# EAGLE design cj-buttons (EAGLE 7.7.0)
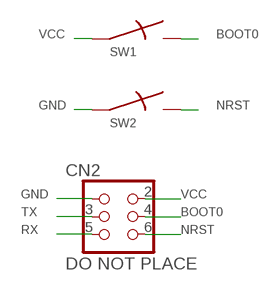
[diagram p0: schematic, sheet 1]

## Parts
CN2  DO NOT PLACE  HEADER-3X2-PTH1.27  [HEADER-3X2-PTH1.27]
SW1  SWITCHKMR211  [KMR211]
SW2  SWITCHKMR211  [KMR211]

## Nets
BOOT0: CN2.4 SW1.2 SW1.4
GND: CN2.1 SW2.1 SW2.3
NRST: CN2.6 SW2.2 SW2.4
RX: CN2.5
TX: CN2.3
VCC: CN2.2 SW1.1 SW1.3

## Library data of the parts
CN2 = jaw-conn:HEADER-3X2
SW1 SW2 = jaw:SWITCH

## Board
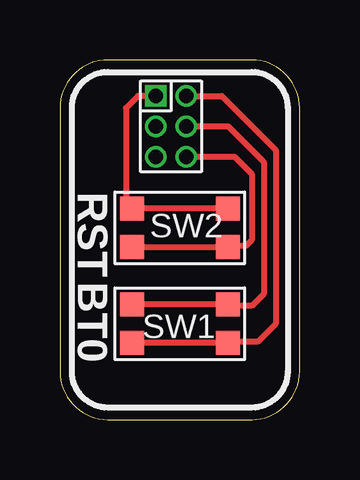
[diagram p1: board, top side]
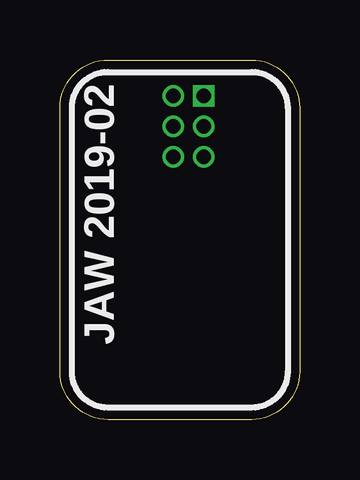
[diagram p2: board, bottom side, seen from below]

Size 10 x 15 mm. Coordinates in mm from the lower left corner, seen from the top.
Outline: 0,13 0,2 arc90 2,0 8,0 arc90 10,2 10,13 arc90 8,15 2,15 arc90 0,13
Copper layers (1*16): Top 0.035559375mm / dielectric 1.6mm / Bottom 0.035559375mm
Design rules "oshpark-2layer": minimum track width 6mil, minimum drill 10mil, track to track 6mil, track to pad 6mil, pad to pad 6mil, via to via 6mil, smd to smd 6mil, copper to edge 15mil, drill to drill 6mil, minimum pad ring 5mil, minimum via ring 5mil, stop-mask expansion 2.5mil, vias tented up to drill 0mil, thermal gap 10mil

### Footprints (pad centres in the part's own frame; a part is rotated, then mirrored left to right if it is on the bottom)
HEADER-3X2-PTH1.27 = drill 0.6 pad 0.9 square: 1 0,0 | drill 0.6 pad 0.9: 2 0,1.27; 3 1.27,0; 4 1.27,1.27; 5 2.54,0; 6 2.54,1.27
KMR211 = smd 1 x 1: 1 -2,0.8; 2 -2,-0.8; 3 2,0.8; 4 2,-0.8

### Placement (x,y rotation side)
CN2  4,13.5 270 top
SW1  5,4 180 top
SW2  5,8 0 top

### Tracks (layer width: path | path; a pad name or v marks a point on that pad's centre or on a via)
BOOT0
  Top 0.25: CN2.4 7.02,12.23 8.5,10.75 8.5,5.25 8,4.75 7.05,4.75 SW1.2 SW1.4
GND
  Top 0.25: SW2.3 SW2.1 2.75,9.05 2.75,13 3.25,13.5 CN2.1
NRST
  Top 0.25: SW2.2 SW2.4 7.05,7.25 7.75,7.25 8,7.5 8,10.25 7.29,10.96 CN2.6
VCC
  Top 0.25: CN2.2 6.75,13.5 9,11.25 9,4 8.25,3.25 7.05,3.25 SW1.1 SW1.3

### Text on the board
tPlace: RST | BT0
bPlace: JAW 2019-02